# Altium schematic sheet E-09 BOOT_CFG.SchDoc: FRDM-IMX93
size 513 x 386 mm; DrawnBy: FORLINX; Organization: ORGANIZATION; Address1: ADDRESS 1; Address2: ADDRESS 2; Address3: ADDRESS 3; Address4: ADDRESS 4; Revision: -; ENG_APP_DATE: --/--/--; DSN_APP_DATE: --/--/--; CHK_APP_DATE: --/--/--; Classification: Public, Company Internal/Proprietary, Company Confidential,  Company Secret; Page Create Date: March  8, 1995; OrgName: NXP Semiconductor; FIUO: A; OrgAddr1: NO. 192 Liangjing Rd. Pudong New Area, ShangHai; Page Number: 9; PageTitle: BOOT CFG; Page Size: C; Page Count: 23; Designer: FORLINX; RevCode: B1; Approver: NXP SE; Doc: SCH-94611 PDF: SPF-94611; DsnPath: T:\FILES\Designs\Single Board Computers\i.MX93-FRDM\Design Files\SCH-94611_B1.DSN; SchematicName: FRDM-i.MX 93 Development Board; PageName: E-09 BOOT_CFG; PageSize: C; TopSchematic: True
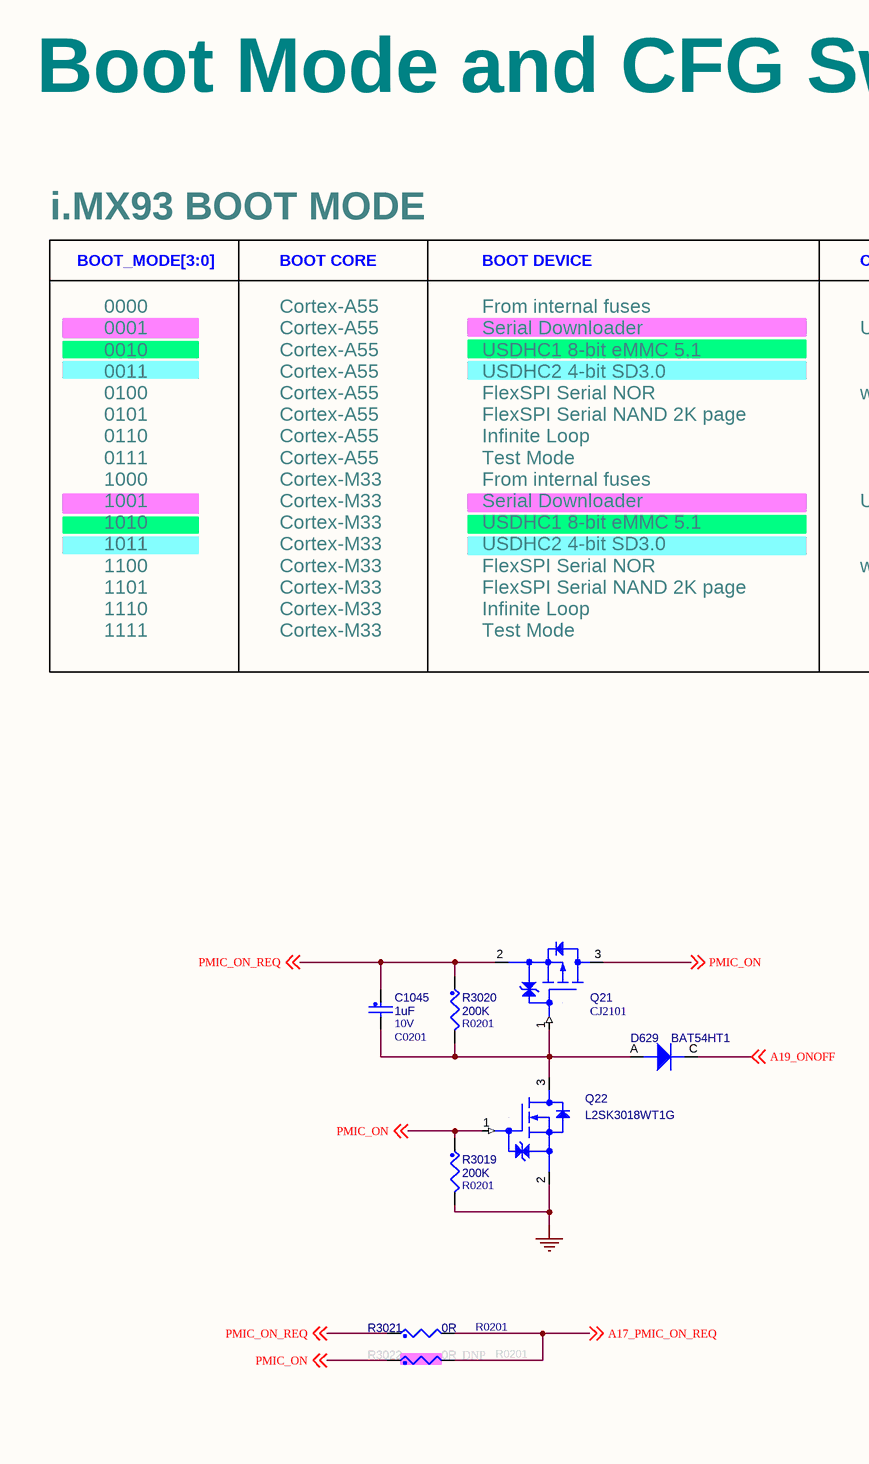
[diagram p0: E-09 BOOT_CFG.SchDoc, left]
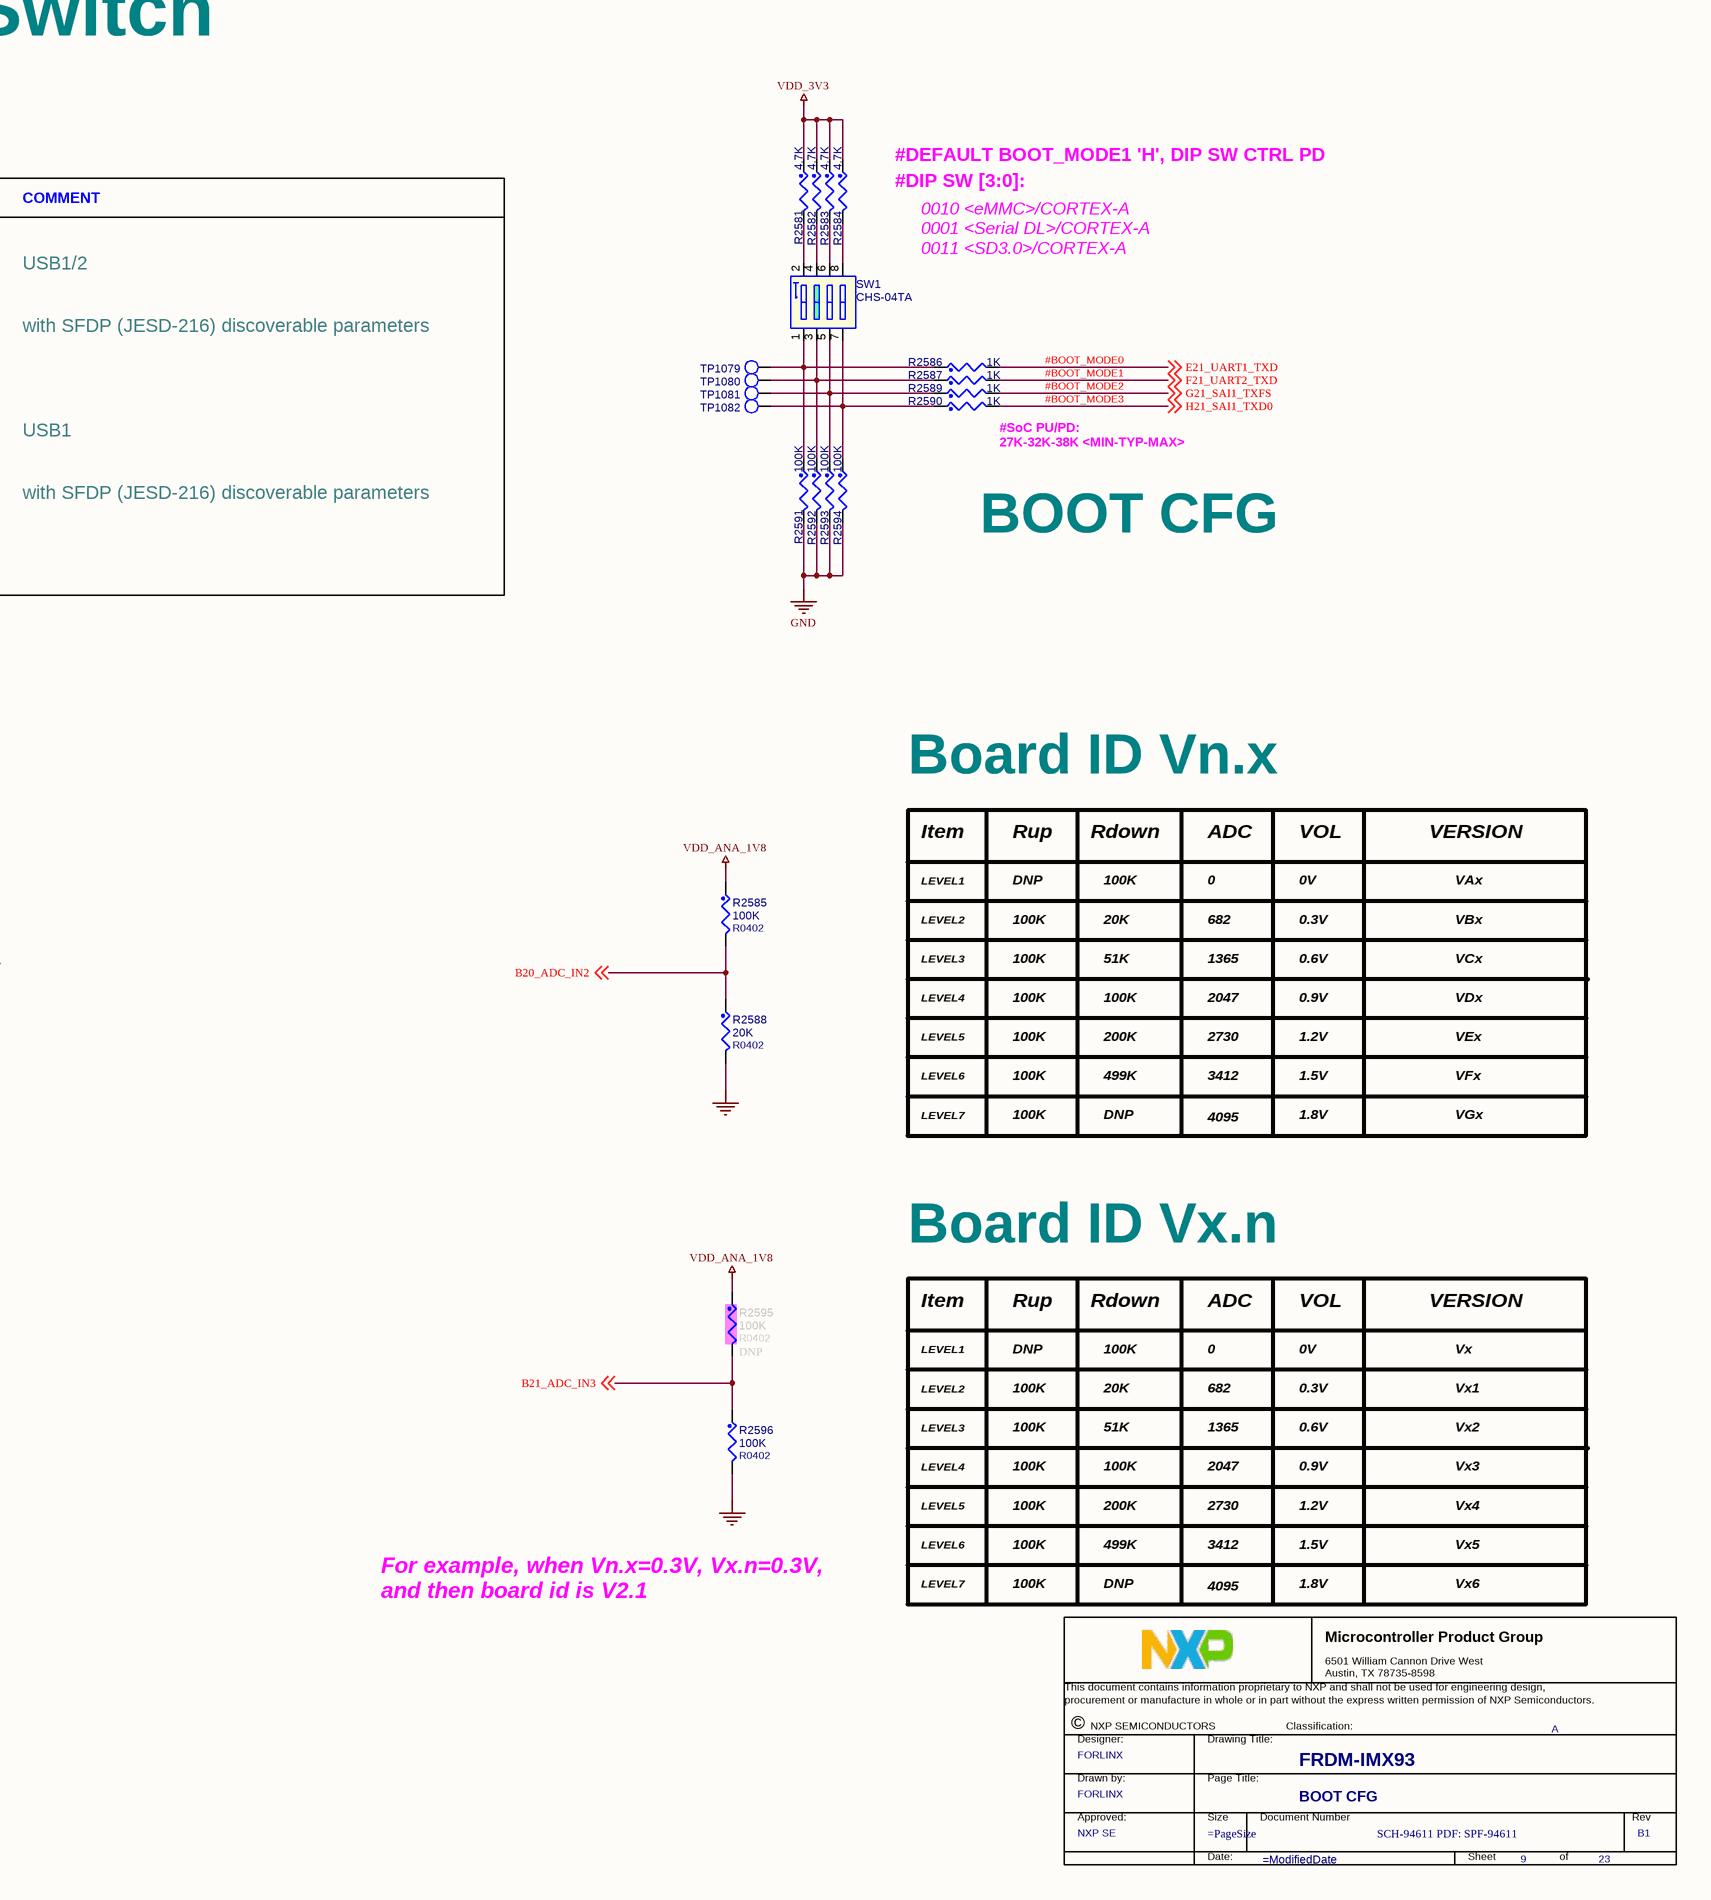
[diagram p1: E-09 BOOT_CFG.SchDoc, right]

## Parts
*  Title: FRDM-IMX93  RevCode: B1  PageTitle: BOOT CFG  Page Number: 9  Page Count: 23  DrawnBy: FORLINX  Doc: SCH-94611 PDF: SPF-94611  Approver: NXP SE  FIUO: A  (graphical)
C1045  1uF  VOLTAGE: 10V  [C0201]
D629  BAT54HT1  [SOD323]
Q21  CJ2101  [sc70_3]
Q22  L2SK3018WT1G  [sc70_3]
R2581  4.7K  [R0201]
R2582  4.7K  [R0201]
R2583  4.7K  [R0201]
R2584  4.7K  [R0201]
R2585  100K  [R0402]
R2586  1K  [R0201]
R2587  1K  [R0201]
R2588  20K  [R0402]
R2589  1K  [R0201]
R2590  1K  [R0201]
R2591  100K  [R0201]
R2592  100K  [R0201]
R2593  100K  [R0201]
R2594  100K  [R0201]
R2595  100K  ASSY_OPT: DNP  [R0402]
R2596  100K  [R0402]
R3019  200K  [R0201]
R3020  200K  [R0201]
R3021  0R  [R0201]
R3022  0R  ASSY_OPT: DNP  [R0201]
SW1  CHS-04TA  [sw_chs_04_a]
TP1079  TPAD_020  [tpad_020]  (value not drawn)
TP1080  TPAD_020  [tpad_020]  (value not drawn)
TP1081  TPAD_020  [tpad_020]  (value not drawn)
TP1082  TPAD_020  [tpad_020]  (value not drawn)

## Nets
GND: Q22.2(SOURCE) R2588.2 R2591.2 R2592.2 R2593.2 R2594.2 R2596.2 R3019.2
VDD_3V3: R2581.1 R2582.1 R2583.1 R2584.1
VDD_ANA_1V8: R2585.1 R2595.1
#BOOT_MODE0: R2586.2 ; off-sheet E21_UART1_TXD  [also labelled E21_UART1_TXD]
#BOOT_MODE1: R2587.2 ; off-sheet F21_UART2_TXD  [also labelled F21_UART2_TXD]
#BOOT_MODE2: R2589.2 ; off-sheet G21_SAI1_TXFS  [also labelled G21_SAI1_TXFS]
#BOOT_MODE3: R2590.2 ; off-sheet H21_SAI1_TXD0  [also labelled H21_SAI1_TXD0]
A17_PMIC_ON_REQ: R3021.2 R3022.2 ; off-sheet A17_PMIC_ON_REQ
A19_ONOFF: D629.C(CATHODE) ; off-sheet A19_ONOFF
B20_ADC_IN2: R2585.2 R2588.1 ; off-sheet B20_ADC_IN2
B21_ADC_IN3: R2595.2 R2596.1 ; off-sheet B21_ADC_IN3
PMIC_ON: Q21.3(DRAIN) Q22.1(GATE) R3019.1 R3022.1 ; off-sheet PMIC_ON
PMIC_ON_REQ: C1045.1 Q21.2(SOURCE) R3020.1 R3021.1 ; off-sheet PMIC_ON_REQ
NetC1045_2: C1045.2 D629.A(ANODE) Q21.1(GATE) Q22.3(DRAIN) R3020.2
NetR2581_2: R2581.2 SW1.2
NetR2582_2: R2582.2 SW1.4
NetR2583_2: R2583.2 SW1.6
NetR2584_2: R2584.2 SW1.8
NetR2586_1: R2586.1 R2591.1 SW1.1 TP1079.1(TP)
NetR2587_1: R2587.1 R2592.1 SW1.3 TP1080.1(TP)
NetR2589_1: R2589.1 R2593.1 SW1.5 TP1081.1(TP)
NetR2590_1: R2590.1 R2594.1 SW1.7 TP1082.1(TP)

## Notes on the sheet
- Boot Mode and CFG Switch
- i.MX93 BOOT MODE
- BOOT_MODE[3:0]
- BOOT CORE
- BOOT DEVICE
- COMMENT
- #DEFAULT BOOT_MODE1 'H', DIP SW CTRL PD
- #DIP SW [3:0]:
- 0010 <eMMC>/CORTEX-A
  0001 <Serial DL>/CORTEX-A
  0011 <SD3.0>/CORTEX-A
- #SoC PU/PD:
  27K-32K-38K <MIN-TYP-MAX>
- 0000
  0001
  0010
  0011
  0100
  0101
  0110
  0111
  1000
  1001
  1010
  1011
  1100
  1101
  1110
  1111
- Cortex-A55
  Cortex-A55
  Cortex-A55
  Cortex-A55
  Cortex-A55
  Cortex-A55
  Cortex-A55
  Cortex-A55
  Cortex-M33
  Cortex-M33
  Cortex-M33
  Cortex-M33
  Cortex-M33
  Cortex-M33
  Cortex-M33
  Cortex-M33
- From internal fuses
  Serial Downloader
  USDHC1 8-bit eMMC 5.1
  USDHC2 4-bit SD3.0
  FlexSPI Serial NOR
  FlexSPI Serial NAND 2K page
  Infinite Loop
  Test Mode
  From internal fuses
  Serial Downloader
  USDHC1 8-bit eMMC 5.1
  USDHC2 4-bit SD3.0
  FlexSPI Serial NOR
  FlexSPI Serial NAND 2K page
  Infinite Loop
  Test Mode
- USB1/2
  with SFDP (JESD-216) discoverable parameters
  USB1
  with SFDP (JESD-216) discoverable parameters
- BOOT CFG
- Board ID Vn.x
- Item
- Rup
- Rdown
- ADC
- VOL
- VERSION
- LEVEL2
- LEVEL1
- 100K
- DNP
- 20K
- 0
- 682
- 0V
- 0.3V
- VAx
- VBx
- LEVEL3
- 51K
- 1365
- 0.6V
- VCx
- LEVEL5
- LEVEL4
- 200K
- 2047
- 2730
- 0.9V
- 1.2V
- VEx
- VDx
- LEVEL7
- LEVEL6
- 499K
- 3412
- 4095
- 1.8V
- 1.5V
- VFx
- VGx
- Board ID Vx.n
- Vx
- Vx2
- Vx1
- Vx4
- Vx3
- Vx5
- For example, when Vn.x=0.3V, Vx.n=0.3V,
  and then board id is V2.1
- (near *) 100K
- (near *) DNP
- Vx6
- DWG. NO.
- REV.
- SHT.
- REVISION
- DESCRIPTION
- DATE
- APPROVED
- ENG:
- APPROVALS
- quilter.ai <http://quilter.ai>
- DSN:
- CHK:
- REFERENCE DOCUMENTS
- TITLE
- PROJECT
- BOM:
- FAB DWG:
- PCB DWG:
- ASSY DWG:
- SIZE
- FILE NAME
- C
- DWG NO.
- SHEET
- OF
- REV
- (in symbol TitleBlock_MCPG) Microcontroller Product Group; 6501 William Cannon Drive West / Austin, TX 78735-8598; This document contains information proprietary to NXP and shall not be used for engineering design,; procurement or manufacture in whole or in part without the express written permission of NXP Semiconductors.; ©; NXP SEMICONDUCTORS; Classification:; Designer:; Drawing Title:; Drawn by:; Page Title:; Approved:; Size; Document Number; Rev; Date:; Sheet; of

## Library data of the parts
* = TitleBlock_MCPG: Classification: Public, Company Internal/Proprietary, Company Confidential,  Company Secret; OrgAddr1: NO. 192 Liangjing Rd. Pudong New Area, ShangHai; OrgName: NXP Semiconductor; Page Size: =PageSize; Page Create Date: March  8, 1995; Designer: FORLINX; Page Modify Date: =ModifiedDate
C1045 = CAP_NP: 0201,1uF,10V,+/-20%,X5R; Part Reference: C1045; CLASS: DISCRETE; Tolerance: 20%; MFG_NAME01: SAMSUNG; MFG_PN01: CL03A105MP3NSNC; CAD_APPROVED: Yes; FPLIST: CC0201,CC0201_HD,0201_CC,0201_CC_012SM_NSP; Value: 1uF; PCB Footprint: C0201; ROHS: Yes; HEIGHT: 0.35MM; Package Size: 0201; Package Type: 7¡± reel
D629 = DIODE: BAT54HT1G,SOD323; Part Reference: D629; CLASS: IC; MFG_NAME01: JSCJ; CAD_APPROVED: Yes; Value: BAT54HT1; PCB Footprint: SOD323; MFG_PN01: BAT54HT1G; HEIGHT: 1.15MM
Q21 = CJ2101: CJ2101,SOT-323,PMOS; Part Reference: Q21; MFG_NAME01: JSCJ; Value: CJ2101; PCB Footprint: sc70_3; MFG_PN01: CJ2101
Q22 = NX3008NBKW_SOT323: Part Reference: Q22; CLASS: IC; MFG_NAME01: LRC; CAD_APPROVED: Yes; Value: L2SK3018WT1G; PCB Footprint: sc70_3; MFG_PN01: L2SK3018WT1G; ROHS: Yes; HEIGHT: 1.1MM
R2581 = RES: 0201,4.7K,+/-1%; Part Reference: R2581; CLASS: DISCRETE; FPLIST: RC0402_25,RC0402_HD,0402_CC,RC0402_X2; Tolerance: 5%; CAD_APPROVED: Yes; MFG_NAME01: FENGHUA; MFG_PN01: RC-01W4701FT; Value: 4.7K; PCB Footprint: R0201; HEIGHT: 0.41mm; ROHS: Yes
R2582 = RES: 0201,4.7K,+/-1%; Part Reference: R2582; CLASS: DISCRETE; MFG_PN01: RC-01W4701FT; MFG_NAME01: FENGHUA; CAD_APPROVED: Yes; Tolerance: 5%; FPLIST: RC0402_25,RC0402_HD,0402_CC,RC0402_X2; Value: 4.7K; PCB Footprint: R0201; ROHS: Yes; HEIGHT: 0.41mm
R2583 = RES: 0201,4.7K,+/-1%; Part Reference: R2583; CLASS: DISCRETE; FPLIST: RC0402_25,RC0402_HD,0402_CC,RC0402_X2; Tolerance: 5%; CAD_APPROVED: Yes; MFG_NAME01: FENGHUA; MFG_PN01: RC-01W4701FT; Value: 4.7K; PCB Footprint: R0201; HEIGHT: 0.41mm; ROHS: Yes
R2584 = RES: 0201,4.7K,+/-1%; Part Reference: R2584; CLASS: DISCRETE; FPLIST: RC0402_25,RC0402_HD,0402_CC,RC0402_X2; Tolerance: 5%; CAD_APPROVED: Yes; MFG_NAME01: FENGHUA; MFG_PN01: RC-01W4701FT; Value: 4.7K; PCB Footprint: R0201; HEIGHT: 0.41mm; ROHS: Yes
R2585 = RES: 0402,100K,+/-1%; Part Reference: R2585; CLASS: DISCRETE; FPLIST: RC0402_25,RC0402_HD,RC0402_X2,0402_CC,CAPC0402_L; CAD_APPROVED: Yes; MFG_PN01: RC-02K1003FT; MFG_NAME01: FENGHUA; Tolerance: 5%; RATING: 1/16W; Value: 100K; PCB Footprint: R0402; HEIGHT: 0.41mm; ROHS: Yes
R2586 = RES: 0201,1K,+/-1%; Part Reference: R2586; CLASS: DISCRETE; FPLIST: RC0402_25,RC0402_HD,RC0402_X2,0402_CC,CAPC0402_L; CAD_APPROVED: Yes; MFG_PN01: RC-01W1001FT; MFG_NAME01: FENGHUA; Tolerance: 5%; RATING: 1/16W; Value: 1K; PCB Footprint: R0201; HEIGHT: 0.41mm; ROHS: Yes
R2587 = RES: 0201,1K,+/-1%; Part Reference: R2587; CLASS: DISCRETE; FPLIST: RC0402_25,RC0402_HD,RC0402_X2,0402_CC,CAPC0402_L; CAD_APPROVED: Yes; MFG_PN01: RC-01W1001FT; MFG_NAME01: FENGHUA; Tolerance: 5%; RATING: 1/16W; Value: 1K; PCB Footprint: R0201; HEIGHT: 0.41mm; ROHS: Yes
R2588 = RES: 0402,20K,+/-1%; Part Reference: R2588; CLASS: DISCRETE; FPLIST: RC0402_25,RC0402_HD,RC0402_X2,0402_CC,CAPC0402_L; CAD_APPROVED: Yes; MFG_PN01: RC-02K2002FT; MFG_NAME01: FENGHUA; Tolerance: 5%; RATING: 1/16W; Value: 20K; PCB Footprint: R0402; HEIGHT: 0.41mm; ROHS: Yes
R2589 = RES: 0201,1K,+/-1%; Part Reference: R2589; CLASS: DISCRETE; FPLIST: RC0402_25,RC0402_HD,RC0402_X2,0402_CC,CAPC0402_L; CAD_APPROVED: Yes; MFG_PN01: RC-01W1001FT; MFG_NAME01: FENGHUA; Tolerance: 5%; RATING: 1/16W; Value: 1K; PCB Footprint: R0201; HEIGHT: 0.41mm; ROHS: Yes
R2590 = RES: 0201,1K,+/-1%; Part Reference: R2590; CLASS: DISCRETE; FPLIST: RC0402_25,RC0402_HD,RC0402_X2,0402_CC,CAPC0402_L; CAD_APPROVED: Yes; MFG_PN01: RC-01W1001FT; MFG_NAME01: FENGHUA; Tolerance: 5%; RATING: 1/16W; Value: 1K; PCB Footprint: R0201; HEIGHT: 0.41mm; ROHS: Yes
R2591 = RES: 0201,100K,+/-1%; Part Reference: R2591; CLASS: DISCRETE; RATING: 1/16W; Tolerance: 5%; MFG_NAME01: FENGHUA; MFG_PN01: RC-01W1003FT; CAD_APPROVED: Yes; FPLIST: RC0402_25,RC0402_HD,RC0402_X2,0402_CC,CAPC0402_L; Value: 100K; PCB Footprint: R0201; ROHS: Yes; HEIGHT: 0.41mm
R2592 = RES: 0201,100K,+/-1%; Part Reference: R2592; CLASS: DISCRETE; VOLTAGE: 50V; Tolerance: 5%; MFG_PN01: RC-01W1003FT; MFG_NAME01: FENGHUA; Temp Range: -55C to +155C; CAD_APPROVED: Yes; FPLIST: RC0402_25,RC0402_HD,0402_CC; Value: 100K; PCB Footprint: R0201; ROHS: Yes; HEIGHT: 0.40 MM
R2593 = RES: 0201,100K,+/-1%; Part Reference: R2593; CLASS: DISCRETE; FPLIST: RC0402_25,RC0402_HD,0402_CC; CAD_APPROVED: Yes; Temp Range: -55C to +155C; MFG_NAME01: FENGHUA; MFG_PN01: RC-01W1003FT; Tolerance: 5%; VOLTAGE: 50V; Value: 100K; PCB Footprint: R0201; HEIGHT: 0.40 MM; ROHS: Yes
R2594 = RES: 0201,100K,+/-1%; Part Reference: R2594; CLASS: DISCRETE; VOLTAGE: 50V; Tolerance: 5%; FPLIST: RC0402_25,RC0402_HD,0402_CC; CAD_APPROVED: Yes; Temp Range: -55C to +155C; MFG_NAME01: FENGHUA; MFG_PN01: RC-01W1003FT; Value: 100K; PCB Footprint: R0201; HEIGHT: 0.40 MM; ROHS: Yes
R2595 = RES: 0402,100K,+/-1%; Part Reference: R2595; CLASS: DISCRETE; FPLIST: RC0402_25,RC0402_HD,RC0402_X2,0402_CC,CAPC0402_L; CAD_APPROVED: Yes; MFG_PN01: RC-02K1003FT; MFG_NAME01: FENGHUA; Tolerance: 5%; RATING: 1/16W; Value: 100K; PCB Footprint: R0402; HEIGHT: 0.41mm; ROHS: Yes
R2596 = RES: 0402,100K,+/-1%; Part Reference: R2596; CLASS: DISCRETE; FPLIST: RC0402_25,RC0402_HD,RC0402_X2,0402_CC,CAPC0402_L; CAD_APPROVED: Yes; MFG_PN01: RC-02K1003FT; MFG_NAME01: FENGHUA; Tolerance: 5%; RATING: 1/16W; Value: 100K; PCB Footprint: R0402; HEIGHT: 0.41mm; ROHS: Yes
R3019 = RES: 0201,200K,+/-1%; Part Reference: R3019; CLASS: DISCRETE; RATING: 1/16W; Tolerance: 5%; MFG_NAME01: FENGHUA; MFG_PN01: RC-01W2003FT; CAD_APPROVED: Yes; FPLIST: RC0402_25,RC0402_HD,RC0402_X2,0402_CC,CAPC0402_L; Value: 200K; PCB Footprint: R0201; ROHS: Yes; HEIGHT: 0.41mm
R3020 = RES: 0201,200K,+/-1%; Part Reference: R3020; CLASS: DISCRETE; FPLIST: RC0402_25,RC0402_HD,RC0402_X2,0402_CC,CAPC0402_L; CAD_APPROVED: Yes; MFG_PN01: RC-01W2003FT; MFG_NAME01: FENGHUA; Tolerance: 5%; RATING: 1/16W; Value: 200K; PCB Footprint: R0201; HEIGHT: 0.41mm; ROHS: Yes
R3021 = RES: 0201,0Ohm,+/-5%; Part Reference: R3021; CLASS: DISCRETE; RATING: 1/16W; Tolerance: 5%; MFG_NAME01: FENGHUA; MFG_PN01: RC-01000JT; CAD_APPROVED: Yes; FPLIST: RC0402_25,RC0402_HD,RC0402_X2,0402_CC,CAPC0402_L; Value: 0R; PCB Footprint: R0201; ROHS: Yes; HEIGHT: 0.41mm
R3022 = RES: 0201,0Ohm,+/-5%; Part Reference: R3022; CLASS: DISCRETE; FPLIST: RC0402_25,RC0402_HD,RC0402_X2,0402_CC,CAPC0402_L; CAD_APPROVED: Yes; MFG_PN01: RC-01000JT; MFG_NAME01: FENGHUA; Tolerance: 5%; RATING: 1/16W; Value: 0R; PCB Footprint: R0201; HEIGHT: 0.41mm; ROHS: Yes
SW1 = CHS-04TA_SW: 4bit,8P,1.27mm,black; Part Reference: SW1; CLASS: IC; CAD_APPROVED: Yes; MFG_NAME01: CTS; MFG_PN01: 4bit-8P-1.27mm; 3D_Mechanical_Footprint_File: ftp://fcl.am.freescale.net/ALLEGRO/step/sw_chs_04_a.step; Value: CHS-04TA; PCB Footprint: sw_chs_04_a; HEIGHT: 2.5MM; ROHS: Yes
TP1079 = T POINT R: no part to order; Part Reference: TP1079; ASSY_OPT: DNP; CLASS: IC; MFG_PN01: NOT A COMPONENT; CAD_APPROVED: Yes; PCB Footprint: tpad_020; MFG_NAME01: NOT A COMPONENT; ROHS: Yes; HEIGHT: 0.1MM
TP1080 = T POINT R: no part to order; Part Reference: TP1080; ASSY_OPT: DNP; CLASS: IC; CAD_APPROVED: Yes; MFG_NAME01: NOT A COMPONENT; PCB Footprint: tpad_020; HEIGHT: 0.1MM; ROHS: Yes; MFG_PN01: NOT A COMPONENT
TP1081 = T POINT R: no part to order; Part Reference: TP1081; ASSY_OPT: DNP; CLASS: IC; CAD_APPROVED: Yes; MFG_NAME01: NOT A COMPONENT; PCB Footprint: tpad_020; HEIGHT: 0.1MM; ROHS: Yes; MFG_PN01: NOT A COMPONENT
TP1082 = T POINT R: no part to order; Part Reference: TP1082; ASSY_OPT: DNP; CLASS: IC; CAD_APPROVED: Yes; MFG_NAME01: NOT A COMPONENT; PCB Footprint: tpad_020; HEIGHT: 0.1MM; ROHS: Yes; MFG_PN01: NOT A COMPONENT